# Altium schematic sheet Line_Sensor.SchDoc
size A4; SheetNumber: 5; SheetTotal: 7
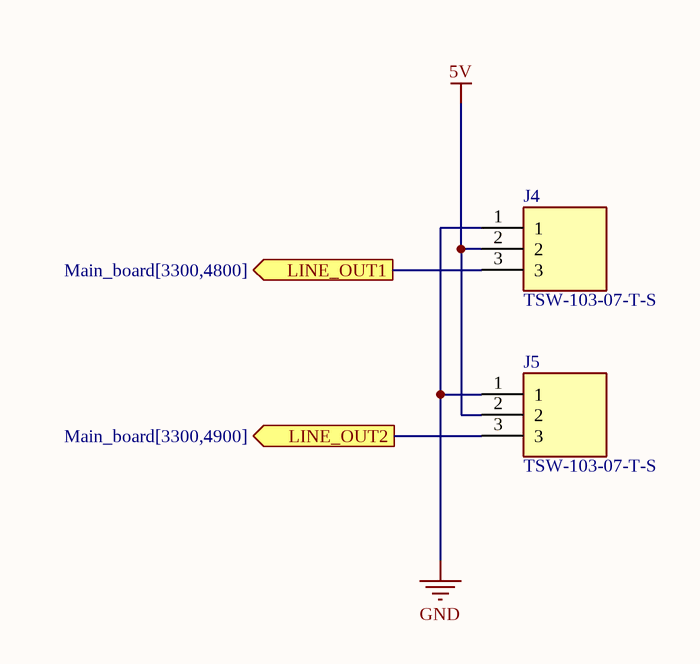
[diagram p0: Line_Sensor.SchDoc]

## Parts
J4  TSW-103-07-T-S  [PCB 3 PIN PADS]
J5  TSW-103-07-T-S  [PCB 3 PIN PADS]

## Ports
LINE_OUT1 (out, see Main_board[3300,4800]), LINE_OUT2 (out, see Main_board[3300,4900])

## Nets
5V: J4.2 J5.2
GND: J4.1 J5.1
LINE_OUT1: J4.3 ; port LINE_OUT1
LINE_OUT2: J5.3 ; port LINE_OUT2

## Library data of the parts
J4 J5 = TSW-103-07-T-S: Connector; Manufacturer_Name: SAMTEC; Datasheet Link: http://suddendocs.samtec.com/prints/tsw-xxx-xx-xxx-x-xx-xxx-mkt.pdf; Manufacturer_Part_Number: TSW-103-07-T-S; Mouser Part Number: 200-TSW10307TS; Mouser Price/Stock: https://www.mouser.co.uk/ProductDetail/Samtec/TSW-103-07-T-S?qs=hzq9O0YpnZs1xDByQQIs%2FQ%3D%3D; Arrow Part Number: TSW-103-07-T-S; Arrow Price/Stock: https://www.arrow.com/en/products/tsw-103-07-t-s/samtec?region=nac